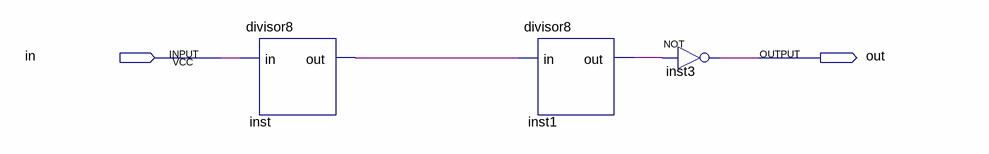
[diagram p0: schematic sheet]
// Quartus schematic divisor16.bdf as structural Verilog: 3 symbols, 2 pins
module divisor16 (
  input  in,
  output out
);

  wire inst1_out, inst_out;

  divisor8 inst (.in(in), .out(inst_out));
  divisor8 inst1 (.in(inst_out), .out(inst1_out));
  not inst3 (out, inst1_out);
endmodule
